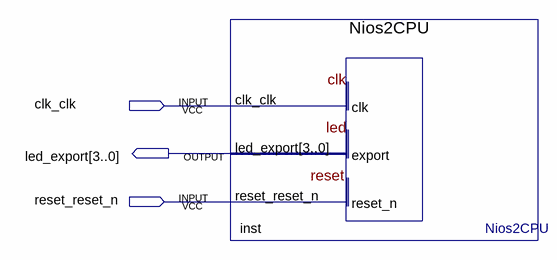
[diagram p0: schematic sheet]
// Quartus schematic CPU_Nios2.bdf as structural Verilog: 1 symbols, 3 pins
module CPU_Nios2 (
  input  clk_clk,
  input  reset_reset_n,
  output [3:0] led_export
);

  Nios2CPU inst (.clk_clk(clk_clk), .reset_reset_n(reset_reset_n), .led_export(led_export));
endmodule
